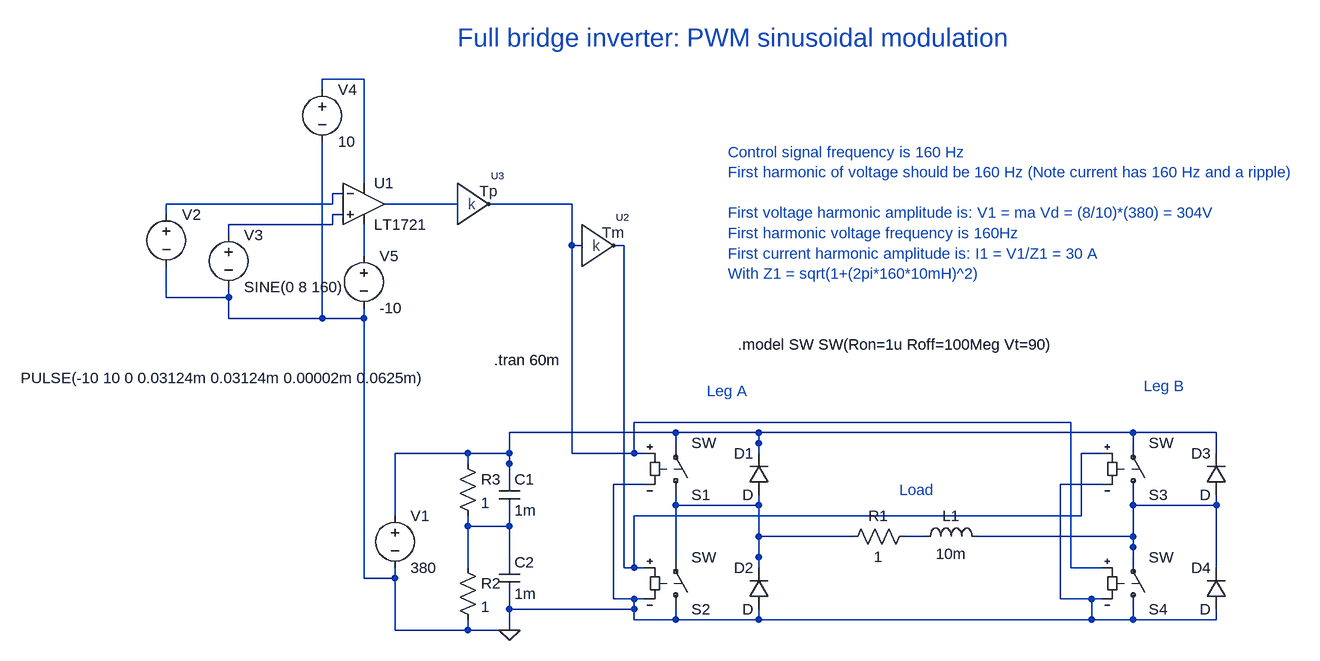
[diagram p0: schematic Full-bridge-inverter.asc]
Full-bridge-inverter.asc, the LTspice schematic file:
Version 4.1
SHEET 1 1668 680
WIRE 176 320 176 336
WIRE 560 336 560 352
WIRE 1264 336 1264 352
WIRE 112 352 112 368
WIRE 384 144 368 144
WIRE 432 336 432 352
WIRE 384 320 368 320
WIRE 1088 144 1072 144
WIRE 1136 336 1136 352
WIRE 1088 320 1072 320
WIRE 0 272 0 288
WIRE -352 -192 -352 -176
WIRE -256 -160 -256 -144
WIRE -112 -384 -112 -368
WIRE -48 -128 -48 -112
WIRE 176 336 176 368
WIRE 176 368 112 368
WIRE 112 368 0 368
WIRE 0 368 0 288
WIRE 176 336 368 336
WIRE 368 336 368 320
WIRE 368 320 368 352
WIRE 368 352 432 352
WIRE 432 352 560 352
WIRE 368 320 336 320
WIRE 336 320 336 144
WIRE 336 144 368 144
WIRE 0 288 -48 288
WIRE -48 288 -48 -112
WIRE -48 -112 -256 -112
WIRE -256 -112 -256 -144
WIRE -256 -144 -352 -144
WIRE -352 -144 -352 -176
WIRE -48 -112 -112 -112
WIRE -112 -112 -112 -368
WIRE 560 352 1072 352
WIRE 1072 352 1072 320
WIRE 1072 320 1072 352
WIRE 1072 352 1136 352
WIRE 1136 352 1264 352
WIRE 1072 320 1024 320
WIRE 1024 320 1024 144
WIRE 1024 144 1072 144
FLAG 176 368 0
WIRE -48 -320 -48 -336
WIRE -112 -464 -112 -480
WIRE -48 -336 -48 -480
WIRE -48 -480 -112 -480
WIRE -80 -304 -96 -304
WIRE -352 -272 -352 -288
WIRE -96 -304 -96 -288
WIRE -96 -288 -352 -288
WIRE -16 -288 0 -288
WIRE 96 -288 80 -288
WIRE 0 -288 80 -288
WIRE -80 -272 -96 -272
WIRE -256 -240 -256 -256
WIRE -96 -272 -96 -256
WIRE -96 -256 -256 -256
WIRE -48 -256 -48 -240
WIRE -48 -208 -48 -224
WIRE -48 -240 -48 -224
WIRE 176 128 176 112
WIRE 560 96 560 80
WIRE 1264 96 1264 80
WIRE 112 112 112 96
WIRE 432 80 432 64
WIRE 1136 80 1136 64
WIRE 0 192 0 176
WIRE 176 112 176 96
WIRE 176 96 112 96
WIRE 112 96 0 96
WIRE 0 96 0 176
WIRE 176 112 176 64
WIRE 176 64 432 64
WIRE 432 64 560 64
WIRE 560 64 560 80
WIRE 560 80 560 64
WIRE 560 64 1136 64
WIRE 1136 64 1264 64
WIRE 1264 64 1264 80
WIRE 176 192 176 208
WIRE 176 256 176 240
WIRE 112 272 112 256
WIRE 112 192 112 208
WIRE 176 208 176 240
WIRE 176 208 112 208
WIRE 112 208 112 256
WIRE 560 160 560 176
WIRE 560 272 560 256
WIRE 704 224 688 224
WIRE 432 160 432 176
WIRE 432 256 432 240
WIRE 560 176 560 256
WIRE 560 176 432 176
WIRE 432 176 432 240
WIRE 560 256 560 224
WIRE 560 224 688 224
WIRE 816 224 800 224
WIRE 784 224 800 224
WIRE 1264 160 1264 176
WIRE 1264 272 1264 256
WIRE 896 224 912 224
WIRE 1136 160 1136 176
WIRE 1136 256 1136 240
WIRE 1264 176 1264 256
WIRE 1264 176 1136 176
WIRE 1136 176 1136 240
WIRE 1136 240 1136 224
WIRE 1136 224 912 224
WIRE 384 272 368 272
WIRE 1088 96 1072 96
WIRE 336 -224 352 -224
WIRE 368 272 352 272
WIRE 352 272 352 -224
WIRE 368 272 368 192
WIRE 368 192 1056 192
WIRE 1056 192 1056 96
WIRE 1056 96 1072 96
FLAG 336 -224 Tm
WIRE 384 96 368 96
WIRE 1088 272 1072 272
WIRE 288 -224 272 -224
WIRE 144 -288 160 -288
WIRE 368 96 272 96
WIRE 272 96 272 -224
WIRE 272 -224 272 -288
WIRE 272 -288 160 -288
WIRE 368 96 368 48
WIRE 368 48 1040 48
WIRE 1040 48 1040 272
WIRE 1040 272 1072 272
FLAG 144 -288 Tp
SYMBOL voltage 0 176 R0
WINDOW 123 0 0 Left 0
WINDOW 39 0 0 Left 0
SYMATTR InstName V1
SYMATTR Value 380
SYMBOL cap 160 128 R0
SYMATTR InstName C1
SYMATTR Value 1m
SYMATTR SpiceLine Rser=1m Rpar=1Meg
SYMBOL cap 160 256 R0
SYMATTR InstName C2
SYMATTR Value 1m
SYMATTR SpiceLine Rser=1m Rpar=1Meg
SYMBOL res 800 208 R90
WINDOW 0 0 56 VBottom 2
WINDOW 3 32 56 VTop 2
SYMATTR InstName R1
SYMATTR Value 1
SYMBOL ind 800 240 R270
WINDOW 0 32 56 VTop 2
WINDOW 3 5 56 VBottom 2
SYMATTR InstName L1
SYMATTR Value 10m
SYMBOL sw 432 176 M180
SYMATTR InstName S1
SYMBOL diode 576 160 R180
WINDOW 0 24 64 Left 2
WINDOW 3 24 0 Left 2
SYMATTR InstName D1
SYMBOL sw 432 352 M180
SYMATTR InstName S2
SYMBOL diode 576 336 R180
WINDOW 0 24 64 Left 2
WINDOW 3 24 0 Left 2
SYMATTR InstName D2
SYMBOL voltage -256 -256 R0
WINDOW 123 0 0 Left 0
WINDOW 39 0 0 Left 0
SYMATTR InstName V3
SYMATTR Value SINE(0 8 160)
SYMBOL Comparators\\LT1721 -48 -352 R0
SYMATTR InstName U1
SYMBOL voltage -112 -480 R0
WINDOW 123 0 0 Left 0
WINDOW 39 0 0 Left 0
SYMATTR InstName V4
SYMATTR Value 10
SYMBOL voltage -48 -224 R0
WINDOW 123 0 0 Left 0
WINDOW 39 0 0 Left 0
SYMATTR InstName V5
SYMATTR Value -10
SYMBOL Gain 304 -224 R0
SYMATTR InstName U2
SYMBOL voltage -352 -288 R0
WINDOW 3 -224 268 Left 2
WINDOW 123 0 0 Left 0
WINDOW 39 0 0 Left 0
SYMATTR Value PULSE(-10 10 0 0.03124m 0.03124m 0.00002m 0.0625m)
SYMATTR InstName V2
SYMBOL Gain 112 -288 R0
SYMATTR SpiceLine G=100
SYMATTR InstName U3
SYMBOL res 96 256 R0
SYMATTR InstName R2
SYMATTR Value 1
SYMBOL res 96 96 R0
SYMATTR InstName R3
SYMATTR Value 1
SYMBOL sw 1136 176 M180
SYMATTR InstName S3
SYMBOL diode 1280 160 R180
WINDOW 0 24 64 Left 2
WINDOW 3 24 0 Left 2
SYMATTR InstName D3
SYMBOL sw 1136 352 M180
SYMATTR InstName S4
SYMBOL diode 1280 336 R180
WINDOW 0 24 64 Left 2
WINDOW 3 24 0 Left 2
SYMATTR InstName D4
TEXT 528 -72 Left 2 !.model SW SW(Ron=1u Roff=100Meg Vt=90)
TEXT 152 -48 Left 2 !.tran 60m
TEXT 512 -368 Left 2 ;Control signal frequency is 160 Hz\nFirst harmonic of voltage should be 160 Hz (Note current has 160 Hz and a ripple)\n \nFirst voltage harmonic amplitude is: V1 = ma Vd = (8/10)*(380) = 304V\nFirst harmonic voltage frequency is 160Hz\nFirst current harmonic amplitude is: I1 = V1/Z1 = 30 A\nWith Z1 = sqrt(1+(2pi*160*10mH)^2)
TEXT 776 152 Left 2 ;Load
TEXT 480 0 Left 2 ;Leg A
TEXT 1152 -8 Left 2 ;Leg B
TEXT 96 -544 Left 4 ;Full bridge inverter: PWM sinusoidal modulation

The netlist it stands for:
* Full-bridge-inverter.asc
V1 N006 0 380
C1 N006 N007 1m Rser=1m Rpar=1Meg
C2 N007 0 1m Rser=1m Rpar=1Meg
R1 N009 N008 1
L1 N009 N010 10m
S1 N008 N006 Tp 0 SW
D1 N008 N006 D
S2 0 N008 Tm 0 SW
D2 0 N008 D
V3 N004 0 SINE(0 8 160)
X§U1 N004 N002 N001 N005 N003 LT1720  ; LT1721, pins In+ In- V+ V- OUT
V4 N001 0 10
V5 N005 0 -10
E§U2 Tp Tm G={G}
V2 N002 0 PULSE(-10 10 0 0.03124m 0.03124m 0.00002m 0.0625m)
E§U3 N003 Tp G={G} G=100
R2 N007 0 1
R3 N006 N007 1
S3 N010 N006 Tm 0 SW
D3 N010 N006 D
S4 0 N010 Tp 0 SW
D4 0 N010 D
.model D D
.lib standard.dio
.model SW SW(Ron=1u Roff=100Meg Vt=90)
.tran 60m
* Control signal frequency is 160 Hz
* First harmonic of voltage should be 160 Hz (Note current has 160 Hz and a ripple)
* First voltage harmonic amplitude is: V1 = ma Vd = (8/10)*(380) = 304V
* First harmonic voltage frequency is 160Hz
* First current harmonic amplitude is: I1 = V1/Z1 = 30 A
* With Z1 = sqrt(1+(2pi*160*10mH)^2)
* Load
* Leg A
* Leg B
* Full bridge inverter: PWM sinusoidal modulation
.lib LTC.lib
.backanno
.end